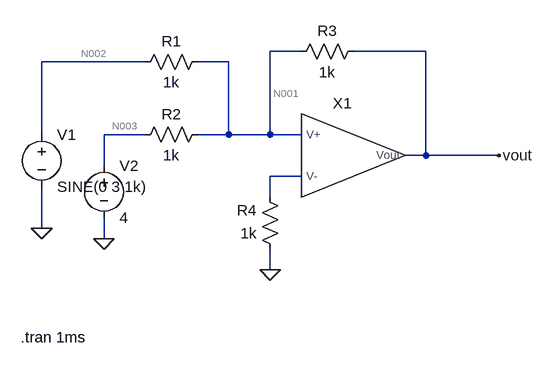
[diagram p0: schematic Differential_Amplifier.asc]
Differential_Amplifier.asc, the LTspice schematic file:
Version 4
SHEET 1 932 680
WIRE 176 32 128 32
WIRE 368 32 256 32
WIRE -64 48 -224 48
WIRE 64 48 16 48
WIRE -224 160 -224 48
WIRE -64 160 -128 160
WIRE 64 160 64 48
WIRE 64 160 16 160
WIRE 128 160 128 32
WIRE 128 160 64 160
WIRE 176 160 128 160
WIRE 368 192 368 32
WIRE 368 192 336 192
WIRE 480 192 368 192
WIRE -128 208 -128 160
WIRE 176 224 128 224
WIRE 128 256 128 224
WIRE -224 304 -224 240
WIRE -128 320 -128 288
WIRE 128 368 128 336
FLAG 480 192 vout
FLAG -224 304 0
FLAG -128 320 0
FLAG 128 368 0
SYMBOL MY_IDEAL_opamp 240 192 R0
SYMATTR InstName X1
SYMBOL voltage -224 144 R0
WINDOW 123 0 0 Left 0
WINDOW 39 0 0 Left 0
SYMATTR InstName V1
SYMATTR Value SINE(0 3 1k)
SYMBOL voltage -128 192 R0
WINDOW 123 0 0 Left 0
WINDOW 39 0 0 Left 0
SYMATTR InstName V2
SYMATTR Value 4
SYMBOL res 32 32 R90
WINDOW 0 0 56 VBottom 2
WINDOW 3 32 56 VTop 2
SYMATTR InstName R1
SYMATTR Value 1k
SYMBOL res 32 144 R90
WINDOW 0 0 56 VBottom 2
WINDOW 3 32 56 VTop 2
SYMATTR InstName R2
SYMATTR Value 1k
SYMBOL res 272 16 R90
WINDOW 0 0 56 VBottom 2
WINDOW 3 32 56 VTop 2
SYMATTR InstName R3
SYMATTR Value 1k
SYMBOL res 144 352 R180
WINDOW 0 36 76 Left 2
WINDOW 3 36 40 Left 2
SYMATTR InstName R4
SYMATTR Value 1k
TEXT -256 472 Left 2 !.tran 1ms

The netlist it stands for:
* Differential_Amplifier.asc
XX1 N001 N004 vout MY_IDEAL_opamp  ; pins V+ V- Vout
V1 N002 0 SINE(0 3 1k)
V2 N003 0 4
R1 N001 N002 1k
R2 N001 N003 1k
R3 vout N001 1k
R4 0 N004 1k
.tran 1ms
.backanno
.end

* Results of the author's LTspice run, read from the files saved beside the schematic
* Operating Point, zero values left out:
*   V(vout) = -4 V
*   V(n001) = 400 nV
*   V(n003) = 4 V
*   I(R3) = -4 mA
*   I(R2) = -4 mA
*   I(R1) = 400 pA
*   I(V2) = -4 mA
*   I(V1) = 400 pA
*   Ix(x1:VOUT) = 4 mA
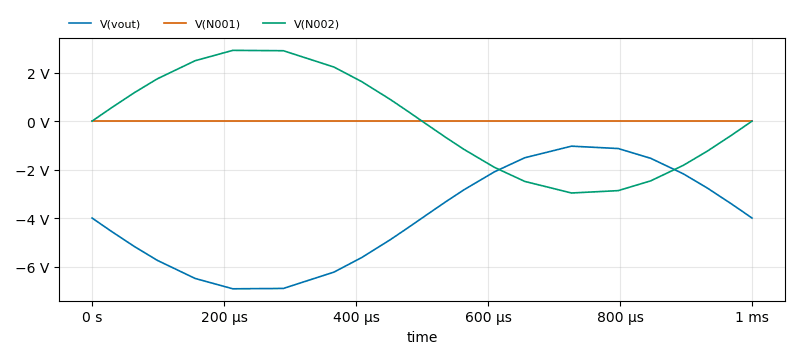
[diagram p1: Transient Analysis of Differential_Amplifier.asc, plotted from the saved traces]
* Transient Analysis, 1 run:
*   V(vout): min -6.92 V, max -1.034 V, average -3.998 V, rms 4.518 V, last -4 V
*   V(N001): min 103.4 nV, max 692 nV, average 399.8 nV, rms 451.8 nV, last 400 nV
*   V(N002): min -2.966 V, max 2.92 V, average -2.188 mV, rms 2.104 V, last 0 V